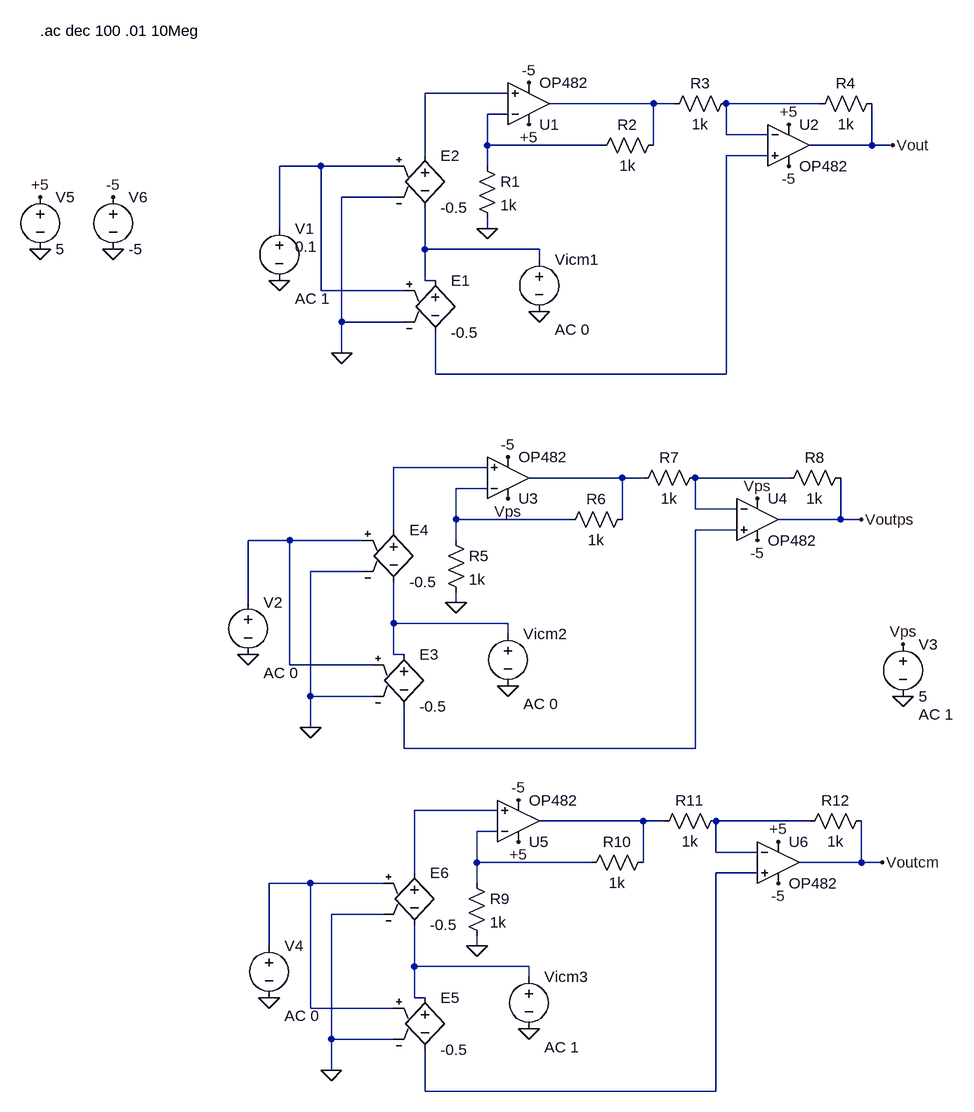
[diagram p0: schematic Etaj1CMRRPSRR.asc]
Etaj1CMRRPSRR.asc, the LTspice schematic file:
Version 4.1
SHEET 1 880 1460
WIRE 64 -80 -64 -80
WIRE 288 -64 128 -64
WIRE 320 -64 288 -64
WIRE 544 -64 400 -64
WIRE 64 -48 32 -48
WIRE 400 -16 400 -64
WIRE 464 -16 400 -16
WIRE 32 0 32 -48
WIRE 208 0 32 0
WIRE 288 0 288 -64
WIRE 624 0 624 -64
WIRE 624 0 528 0
WIRE 656 0 624 0
WIRE -64 16 -64 -80
WIRE 464 16 400 16
WIRE -224 32 -288 32
WIRE -112 32 -224 32
WIRE 32 32 32 0
WIRE -112 80 -192 80
WIRE -288 128 -288 32
WIRE 32 128 32 112
WIRE -64 160 -64 96
WIRE 112 160 -64 160
WIRE 112 176 112 160
WIRE -64 208 -64 160
WIRE -48 208 -64 208
WIRE -224 224 -224 32
WIRE -96 224 -224 224
WIRE -192 272 -192 80
WIRE -96 272 -192 272
WIRE -192 320 -192 272
WIRE -48 352 -48 288
WIRE 400 352 400 16
WIRE 400 352 -48 352
WIRE 32 496 -112 496
WIRE 240 512 96 512
WIRE 272 512 240 512
WIRE 496 512 352 512
WIRE 32 528 -16 528
WIRE 352 560 352 512
WIRE 416 560 352 560
WIRE -16 576 -16 528
WIRE 160 576 -16 576
WIRE 240 576 240 512
WIRE 576 576 576 512
WIRE 576 576 480 576
WIRE 608 576 576 576
WIRE -112 592 -112 496
WIRE 416 592 352 592
WIRE -272 608 -336 608
WIRE -160 608 -272 608
WIRE -16 608 -16 576
WIRE -160 656 -240 656
WIRE -336 704 -336 608
WIRE -16 704 -16 688
WIRE -112 736 -112 672
WIRE 64 736 -112 736
WIRE 64 752 64 736
WIRE -112 784 -112 736
WIRE -96 784 -112 784
WIRE -272 800 -272 608
WIRE -144 800 -272 800
WIRE -240 848 -240 656
WIRE -144 848 -240 848
WIRE -240 896 -240 848
WIRE -96 928 -96 864
WIRE 352 928 352 592
WIRE 352 928 -96 928
WIRE 48 1024 -80 1024
WIRE 272 1040 112 1040
WIRE 304 1040 272 1040
WIRE 528 1040 384 1040
WIRE 48 1056 16 1056
WIRE 384 1088 384 1040
WIRE 448 1088 384 1088
WIRE 16 1104 16 1056
WIRE 192 1104 16 1104
WIRE 272 1104 272 1040
WIRE 608 1104 608 1040
WIRE 608 1104 512 1104
WIRE 640 1104 608 1104
WIRE -80 1120 -80 1024
WIRE 448 1120 384 1120
WIRE -240 1136 -304 1136
WIRE -128 1136 -240 1136
WIRE 16 1136 16 1104
WIRE -128 1184 -208 1184
WIRE -304 1232 -304 1136
WIRE 16 1232 16 1216
WIRE -80 1264 -80 1200
WIRE 96 1264 -80 1264
WIRE 96 1280 96 1264
WIRE -80 1312 -80 1264
WIRE -64 1312 -80 1312
WIRE -240 1328 -240 1136
WIRE -112 1328 -240 1328
WIRE -208 1376 -208 1184
WIRE -112 1376 -208 1376
WIRE -208 1424 -208 1376
WIRE -64 1456 -64 1392
WIRE 384 1456 384 1120
WIRE 384 1456 -64 1456
FLAG 32 128 0
FLAG 96 -32 +5
FLAG 96 -96 -5
FLAG 496 32 -5
FLAG 496 -32 +5
FLAG -192 320 0
FLAG -288 208 0
FLAG 112 256 0
FLAG 656 0 Vout
FLAG -16 704 0
FLAG 608 576 Voutps
FLAG 64 544 Vps
FLAG 64 480 -5
FLAG 448 608 -5
FLAG 448 544 Vps
FLAG -240 896 0
FLAG -336 784 0
FLAG 64 832 0
FLAG 672 768 Vps
FLAG 672 848 0
FLAG 16 1232 0
FLAG 640 1104 Voutcm
FLAG 80 1072 +5
FLAG 80 1008 -5
FLAG 480 1136 -5
FLAG 480 1072 +5
FLAG -208 1424 0
FLAG -304 1312 0
FLAG 96 1360 0
FLAG -656 80 +5
FLAG -544 80 -5
FLAG -656 160 0
FLAG -544 160 0
DATAFLAG 432 -64 ""
DATAFLAG -64 -32 ""
DATAFLAG -16 352 ""
DATAFLAG 624 -32 ""
SYMBOL OpAmps\\OP482 96 0 M180
SYMATTR InstName U1
SYMBOL OpAmps\\OP482 496 -64 R0
SYMATTR InstName U2
SYMBOL res 16 16 R0
SYMATTR InstName R1
SYMATTR Value 1k
SYMBOL res 304 -16 R90
WINDOW 0 0 56 VBottom 2
WINDOW 3 32 56 VTop 2
SYMATTR InstName R2
SYMATTR Value 1k
SYMBOL res 416 -80 R90
WINDOW 0 0 56 VBottom 2
WINDOW 3 32 56 VTop 2
SYMATTR InstName R3
SYMATTR Value 1k
SYMBOL res 640 -80 R90
WINDOW 0 0 56 VBottom 2
WINDOW 3 32 56 VTop 2
SYMATTR InstName R4
SYMATTR Value 1k
SYMBOL e -48 192 R0
SYMATTR InstName E1
SYMATTR Value -0.5
SYMBOL e -64 0 R0
SYMATTR InstName E2
SYMATTR Value -0.5
SYMBOL voltage -288 112 R0
WINDOW 123 24 124 Left 2
WINDOW 39 0 0 Left 0
WINDOW 3 24 44 Left 2
SYMATTR Value2 AC 1
SYMATTR Value 0.1
SYMATTR InstName V1
SYMBOL voltage 112 160 R0
WINDOW 123 24 124 Left 2
WINDOW 39 0 0 Left 0
SYMATTR Value2 AC 0
SYMATTR InstName Vicm1
SYMATTR Value ""
SYMBOL OpAmps\\OP482 64 576 M180
SYMATTR InstName U3
SYMBOL OpAmps\\OP482 448 512 R0
SYMATTR InstName U4
SYMBOL res -32 592 R0
SYMATTR InstName R5
SYMATTR Value 1k
SYMBOL res 256 560 R90
WINDOW 0 0 56 VBottom 2
WINDOW 3 32 56 VTop 2
SYMATTR InstName R6
SYMATTR Value 1k
SYMBOL res 368 496 R90
WINDOW 0 0 56 VBottom 2
WINDOW 3 32 56 VTop 2
SYMATTR InstName R7
SYMATTR Value 1k
SYMBOL res 592 496 R90
WINDOW 0 0 56 VBottom 2
WINDOW 3 32 56 VTop 2
SYMATTR InstName R8
SYMATTR Value 1k
SYMBOL e -96 768 R0
SYMATTR InstName E3
SYMATTR Value -0.5
SYMBOL e -112 576 R0
SYMATTR InstName E4
SYMATTR Value -0.5
SYMBOL voltage -336 688 R0
WINDOW 123 24 124 Left 2
WINDOW 39 0 0 Left 0
SYMATTR Value2 AC 0
SYMATTR InstName V2
SYMATTR Value ""
SYMBOL voltage 64 736 R0
WINDOW 123 24 124 Left 2
WINDOW 39 0 0 Left 0
SYMATTR Value2 AC 0
SYMATTR InstName Vicm2
SYMATTR Value ""
SYMBOL voltage 672 752 R0
WINDOW 123 24 124 Left 2
WINDOW 39 0 0 Left 0
SYMATTR Value2 AC 1
SYMATTR InstName V3
SYMATTR Value 5
SYMBOL OpAmps\\OP482 80 1104 M180
SYMATTR InstName U5
SYMBOL OpAmps\\OP482 480 1040 R0
SYMATTR InstName U6
SYMBOL res 0 1120 R0
SYMATTR InstName R9
SYMATTR Value 1k
SYMBOL res 288 1088 R90
WINDOW 0 0 56 VBottom 2
WINDOW 3 32 56 VTop 2
SYMATTR InstName R10
SYMATTR Value 1k
SYMBOL res 400 1024 R90
WINDOW 0 0 56 VBottom 2
WINDOW 3 32 56 VTop 2
SYMATTR InstName R11
SYMATTR Value 1k
SYMBOL res 624 1024 R90
WINDOW 0 0 56 VBottom 2
WINDOW 3 32 56 VTop 2
SYMATTR InstName R12
SYMATTR Value 1k
SYMBOL e -64 1296 R0
SYMATTR InstName E5
SYMATTR Value -0.5
SYMBOL e -80 1104 R0
SYMATTR InstName E6
SYMATTR Value -0.5
SYMBOL voltage 96 1264 R0
WINDOW 123 24 124 Left 2
WINDOW 39 0 0 Left 0
SYMATTR Value2 AC 1
SYMATTR InstName Vicm3
SYMATTR Value ""
SYMBOL voltage -304 1216 R0
WINDOW 123 24 124 Left 2
WINDOW 39 0 0 Left 0
SYMATTR Value2 AC 0
SYMATTR InstName V4
SYMATTR Value ""
SYMBOL voltage -656 64 R0
SYMATTR InstName V5
SYMATTR Value 5
SYMBOL voltage -544 64 R0
SYMATTR InstName V6
SYMATTR Value -5
TEXT -656 -176 Left 2 !.ac dec 100 .01 10Meg

The netlist it stands for:
* Etaj1CMRRPSRR.asc
X§U1 N001 N004 +5 -5 N002 OP482  ; pins In+ In- V+ V- OUT
X§U2 N005 N003 +5 -5 Vout OP482  ; pins In+ In- V+ V- OUT
R1 N004 0 1k
R2 N002 N004 1k
R3 N003 N002 1k
R4 Vout N003 1k
E1 N007 N005 N006 0 -0.5
E2 N001 N007 N006 0 -0.5
V1 N006 0 0.1 AC 1
Vicm1 N007 0 AC 0
X§U3 N008 N011 Vps -5 N009 OP482  ; pins In+ In- V+ V- OUT
X§U4 N012 N010 Vps -5 Voutps OP482  ; pins In+ In- V+ V- OUT
R5 N011 0 1k
R6 N009 N011 1k
R7 N010 N009 1k
R8 Voutps N010 1k
E3 N014 N012 N013 0 -0.5
E4 N008 N014 N013 0 -0.5
V2 N013 0 AC 0
Vicm2 N014 0 AC 0
V3 Vps 0 5 AC 1
X§U5 N015 N018 +5 -5 N016 OP482  ; pins In+ In- V+ V- OUT
X§U6 N019 N017 +5 -5 Voutcm OP482  ; pins In+ In- V+ V- OUT
R9 N018 0 1k
R10 N016 N018 1k
R11 N017 N016 1k
R12 Voutcm N017 1k
E5 N021 N019 N020 0 -0.5
E6 N015 N021 N020 0 -0.5
Vicm3 N021 0 AC 1
V4 N020 0 AC 0
V5 +5 0 5
V6 -5 0 -5
.ac dec 100 .01 10Meg
.backanno
.end